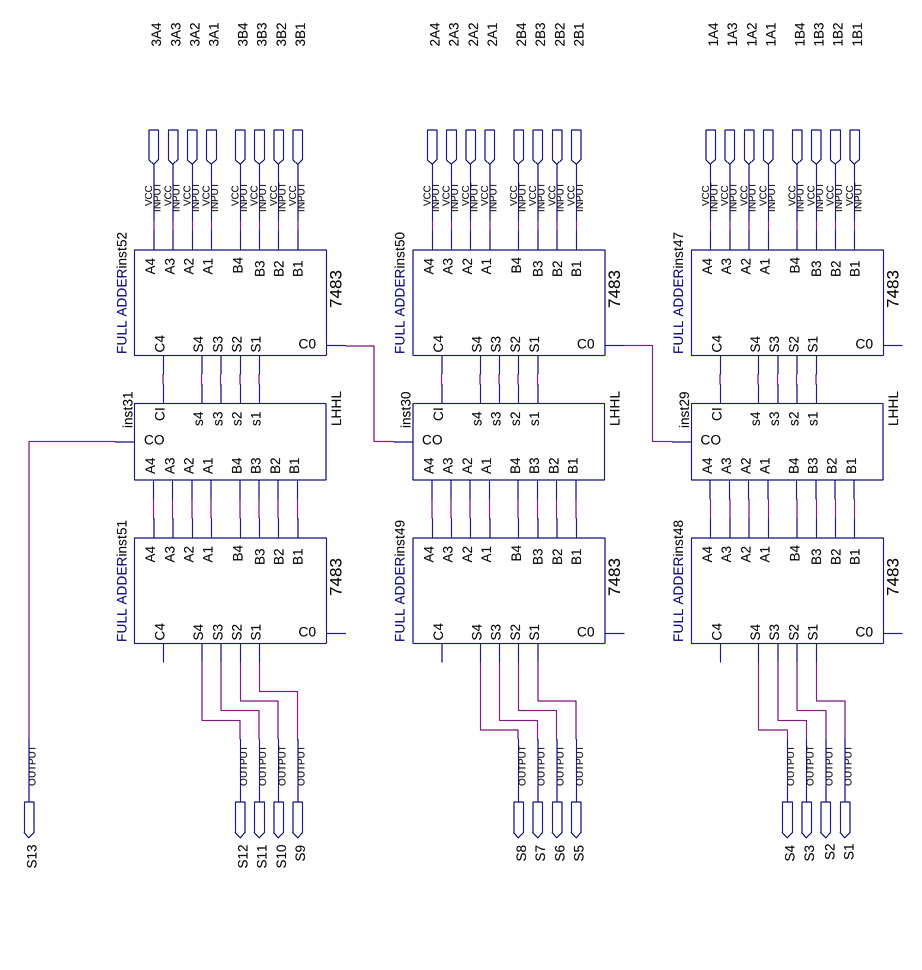
[diagram p0: schematic sheet]
// Quartus schematic 12bit.bdf as structural Verilog: 9 symbols, 37 pins
module \12bit  (
  input  \3A4 ,
  input  \3A3 ,
  input  \3A2 ,
  input  \3A1 ,
  input  \3B4 ,
  input  \3B3 ,
  input  \3B2 ,
  input  \3B1 ,
  input  \2A4 ,
  input  \2A3 ,
  input  \2A2 ,
  input  \2A1 ,
  input  \2B4 ,
  input  \2B3 ,
  input  \2B2 ,
  input  \2B1 ,
  input  \1A4 ,
  input  \1A3 ,
  input  \1A2 ,
  input  \1A1 ,
  input  \1B4 ,
  input  \1B3 ,
  input  \1B2 ,
  input  \1B1 ,
  output S13,
  output S12,
  output S11,
  output S10,
  output S9,
  output S8,
  output S7,
  output S6,
  output S5,
  output S4,
  output S3,
  output S2,
  output S1
);

  wire inst29_a1, inst29_a2, inst29_a3, inst29_a4, inst29_b1, inst29_b2, inst29_b3, inst29_b4, inst29_co,
       inst30_a1, inst30_a2, inst30_a3, inst30_a4, inst30_b1, inst30_b2, inst30_b3, inst30_b4, inst30_co,
       inst31_a1, inst31_a2, inst31_a3, inst31_a4, inst31_b1, inst31_b2, inst31_b3, inst31_b4, inst47_c4,
       inst47_s1, inst47_s2, inst47_s3, inst47_s4, inst50_c4, inst50_s1, inst50_s2, inst50_s3, inst50_s4,
       inst52_c4, inst52_s1, inst52_s2, inst52_s3, inst52_s4;

  \7483  inst52 (
    .B4(\3B4 ), .C0(inst30_co), .A1(\3A1 ), .A2(\3A2 ), .B1(\3B1 ), .B2(\3B2 ), .A3(\3A3 ), .B3(\3B3 ),
    .A4(\3A4 ), .S3(inst52_s3), .S4(inst52_s4), .S2(inst52_s2), .C4(inst52_c4), .S1(inst52_s1));
  LHHL inst31 (
    .s1(inst52_s1), .s2(inst52_s2), .CI(inst52_c4), .s3(inst52_s3), .s4(inst52_s4), .B1(inst31_b1),
    .B2(inst31_b2), .B3(inst31_b3), .B4(inst31_b4), .CO(S13), .A1(inst31_a1), .A2(inst31_a2), .A3(inst31_a3),
    .A4(inst31_a4));
  \7483  inst51 (
    .B4(inst31_b4), .A1(inst31_a1), .A2(inst31_a2), .B1(inst31_b1), .B2(inst31_b2), .A3(inst31_a3),
    .B3(inst31_b3), .A4(inst31_a4), .S3(S11), .S4(S12), .S2(S10), .S1(S9));  // open: C0, C4
  \7483  inst50 (
    .B4(\2B4 ), .C0(inst29_co), .A1(\2A1 ), .A2(\2A2 ), .B1(\2B1 ), .B2(\2B2 ), .A3(\2A3 ), .B3(\2B3 ),
    .A4(\2A4 ), .S3(inst50_s3), .S4(inst50_s4), .S2(inst50_s2), .C4(inst50_c4), .S1(inst50_s1));
  LHHL inst30 (
    .s1(inst50_s1), .s2(inst50_s2), .CI(inst50_c4), .s3(inst50_s3), .s4(inst50_s4), .B1(inst30_b1),
    .B2(inst30_b2), .B3(inst30_b3), .B4(inst30_b4), .CO(inst30_co), .A1(inst30_a1), .A2(inst30_a2),
    .A3(inst30_a3), .A4(inst30_a4));
  \7483  inst49 (
    .B4(inst30_b4), .A1(inst30_a1), .A2(inst30_a2), .B1(inst30_b1), .B2(inst30_b2), .A3(inst30_a3),
    .B3(inst30_b3), .A4(inst30_a4), .S3(S7), .S4(S8), .S2(S6), .S1(S5));  // open: C0, C4
  \7483  inst47 (
    .B4(\1B4 ), .A1(\1A1 ), .A2(\1A2 ), .B1(\1B1 ), .B2(\1B2 ), .A3(\1A3 ), .B3(\1B3 ), .A4(\1A4 ),
    .S3(inst47_s3), .S4(inst47_s4), .S2(inst47_s2), .C4(inst47_c4), .S1(inst47_s1));  // open: C0
  LHHL inst29 (
    .s1(inst47_s1), .s2(inst47_s2), .CI(inst47_c4), .s3(inst47_s3), .s4(inst47_s4), .B1(inst29_b1),
    .B2(inst29_b2), .B3(inst29_b3), .B4(inst29_b4), .CO(inst29_co), .A1(inst29_a1), .A2(inst29_a2),
    .A3(inst29_a3), .A4(inst29_a4));
  \7483  inst48 (
    .B4(inst29_b4), .A1(inst29_a1), .A2(inst29_a2), .B1(inst29_b1), .B2(inst29_b2), .A3(inst29_a3),
    .B3(inst29_b3), .A4(inst29_a4), .S3(S3), .S4(S4), .S2(S2), .S1(S1));  // open: C0, C4
endmodule
